# Altium schematic sheet hwmon_1.SchDoc: Hardware Monitoring
size A3; Date: DO NOT USE, RATHER USE PROJ OPTIONS; DrawnBy: DO NOT USE, RATHER USE PROJ OPTIONS; Engineer: DO NOT USE, RATHER USE PROJ OPTIONS; Organization: DO NOT USE, RATHER USE PROJ OPTIONS; DocumentNumber: DO NOT USE, RATHER USE PROJ OPTIONS; Revision: DO NOT USE, RATHER USE PROJ OPTIONS; SheetNumber: 3; SheetTotal: 29; SCH_Sheet_Filename: hwmon_1.SchDoc; CurrentTime: DO NOT USE, RATHER USE PROJ OPTIONS; Time: DO NOT USE, RATHER USE PROJ OPTIONS; DocumentFullPathAndName: DO NOT USE, RATHER USE PROJ OPTIONS; DocumentName: DO NOT USE, RATHER USE PROJ OPTIONS; ModifiedDate: DO NOT USE, RATHER USE PROJ OPTIONS; ImagePath: DO NOT USE, RATHER USE PROJ OPTIONS
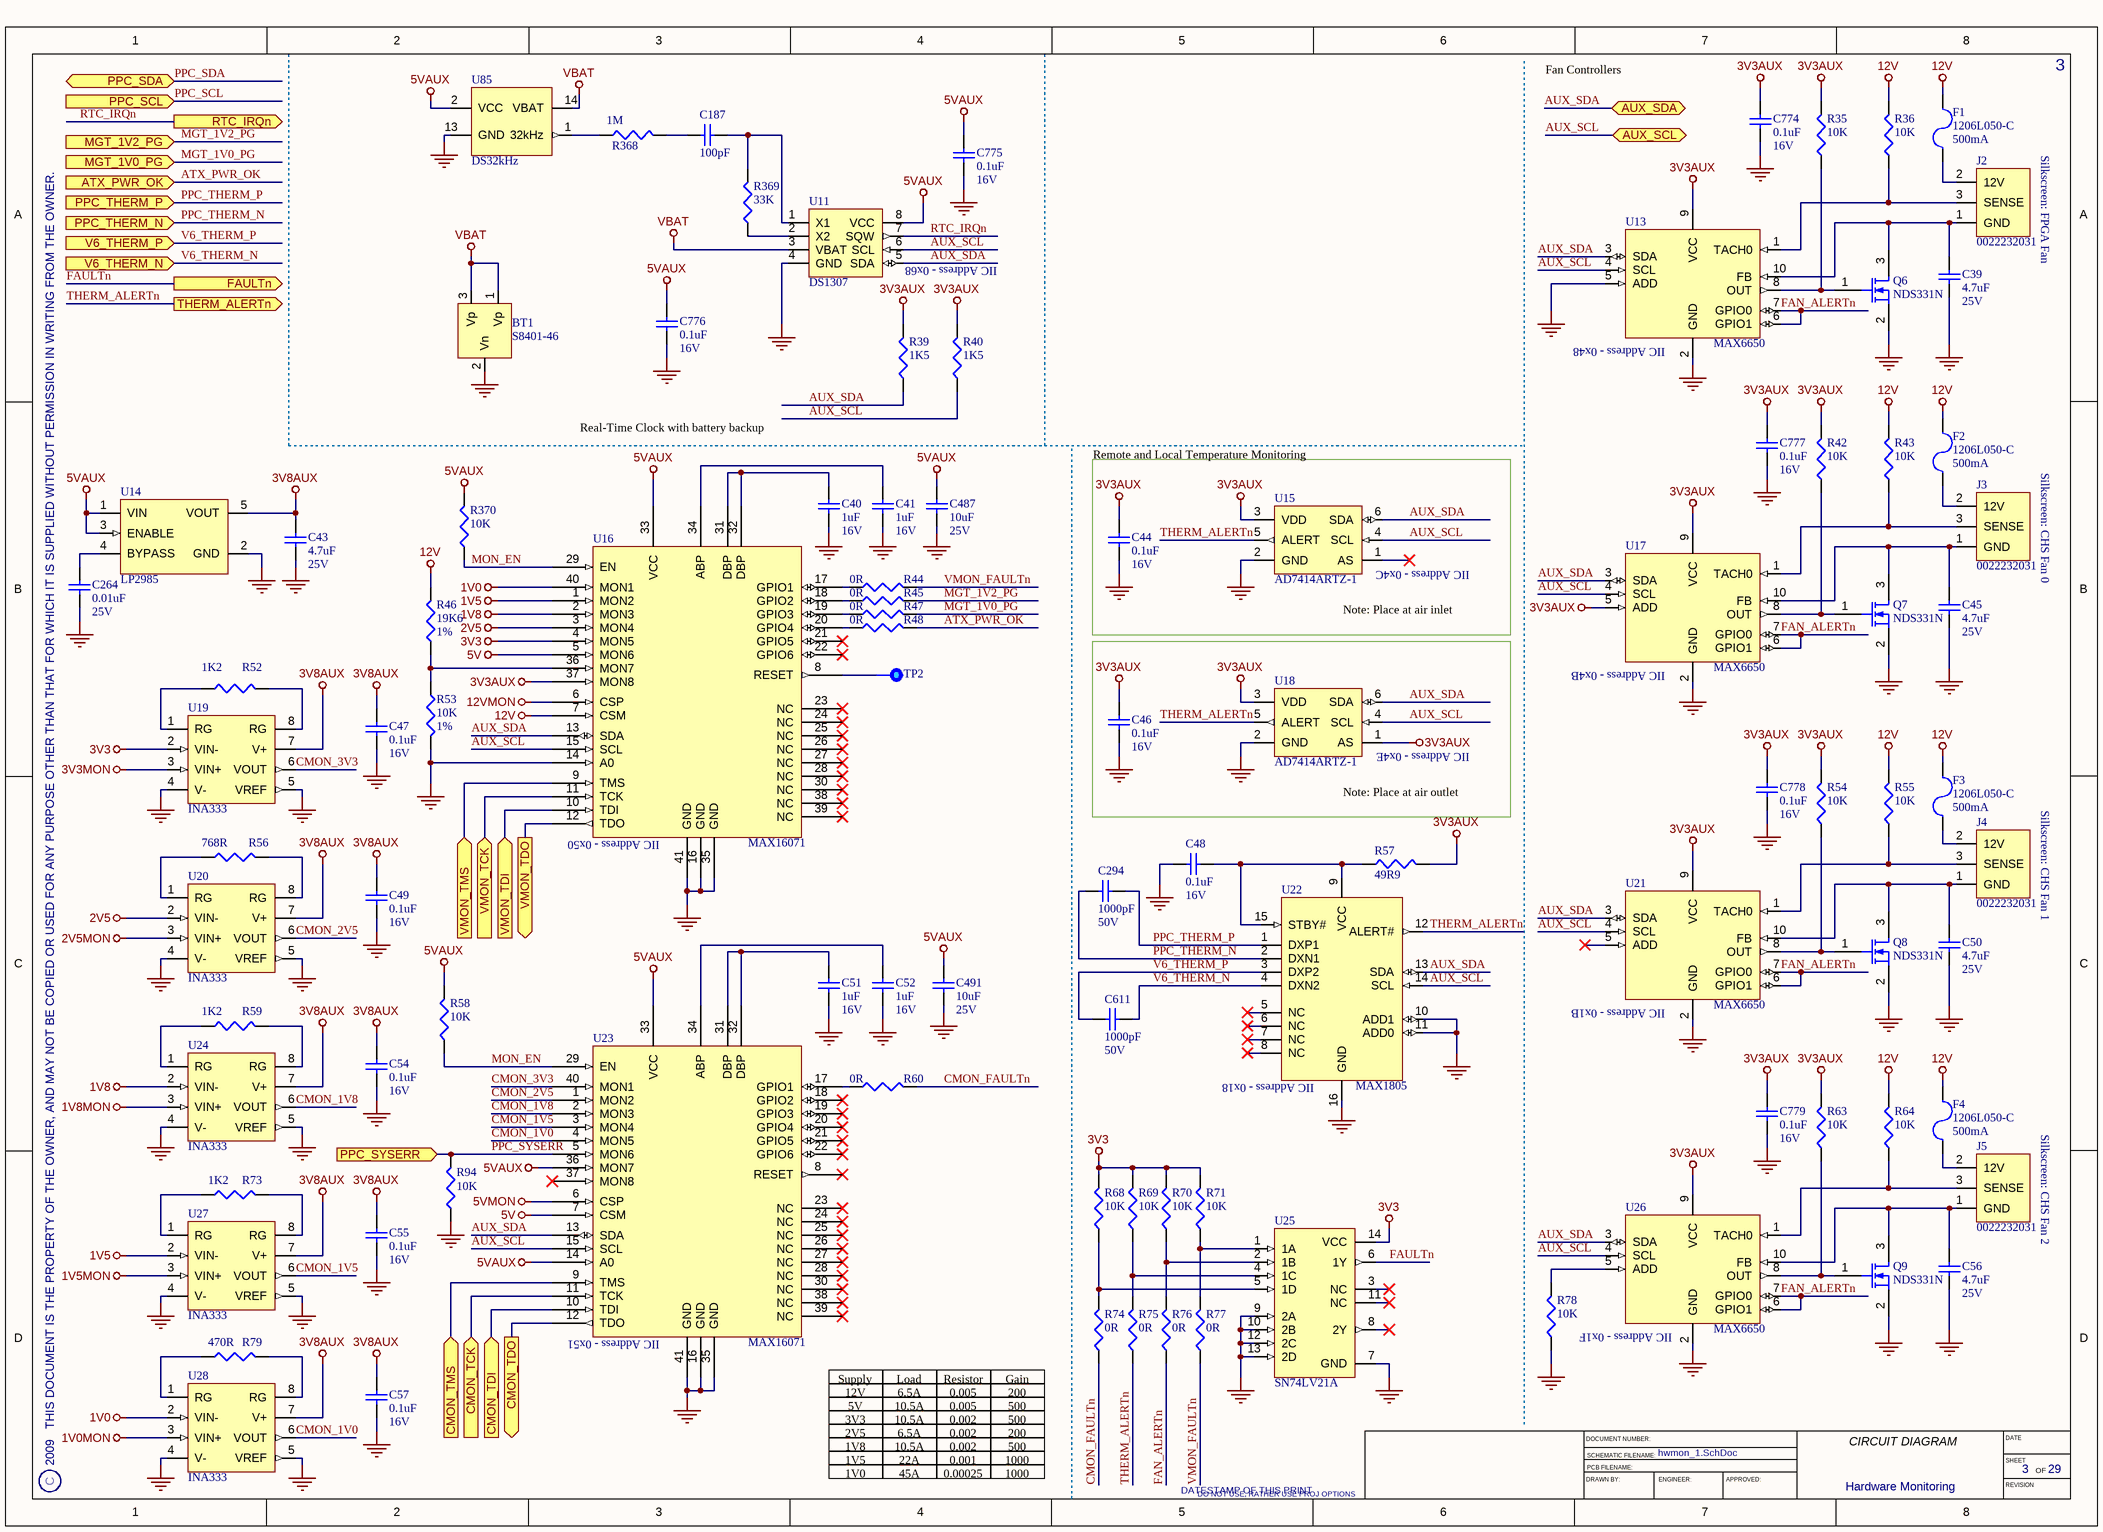
[diagram p0: hwmon_1.SchDoc]

## Parts
BT1  S8401-46  [HARWIN_S8401-46]
C39  Rating: 25V  [CAPC2012X127L]  (hidden comment: 4.7uF)
C40  Rating: 16V  [CAPC2012X127L]  (hidden comment: 1uF)
C41  Rating: 16V  [CAPC2012X127L]  (hidden comment: 1uF)
C43  Rating: 25V  [CAPC2012X127L]  (hidden comment: 4.7uF)
C44  Rating: 16V  [CAPC1005X60L]  (hidden comment: 0.1uF)
C45  Rating: 25V  [CAPC2012X127L]  (hidden comment: 4.7uF)
C46  Rating: 16V  [CAPC1005X60L]  (hidden comment: 0.1uF)
C47  Rating: 16V  [CAPC1005X60L]  (hidden comment: 0.1uF)
C48  Rating: 16V  [CAPC1005X60L]  (hidden comment: 0.1uF)
C49  Rating: 16V  [CAPC1005X60L]  (hidden comment: 0.1uF)
C50  Rating: 25V  [CAPC2012X127L]  (hidden comment: 4.7uF)
C51  Rating: 16V  [CAPC2012X127L]  (hidden comment: 1uF)
C52  Rating: 16V  [CAPC2012X127L]  (hidden comment: 1uF)
C54  Rating: 16V  [CAPC1005X60L]  (hidden comment: 0.1uF)
C55  Rating: 16V  [CAPC1005X60L]  (hidden comment: 0.1uF)
C56  Rating: 25V  [CAPC2012X127L]  (hidden comment: 4.7uF)
C57  Rating: 16V  [CAPC1005X60L]  (hidden comment: 0.1uF)
C187  100pF  [CAPC1005X55L]
C264  value 0.01uF  Rating: 25V  [CAPC1005X55L]  (hidden comment: CapStd)
C294  Rating: 50V  [CAPC1005X55L]  (hidden comment: 1000pF)
C487  Rating: 25V  [CAPC3225X200L]  (hidden comment: 10uF)
C491  Rating: 25V  [CAPC3225X200L]  (hidden comment: 10uF)
C611  Rating: 50V  [CAPC1005X55L]  (hidden comment: 1000pF)
C774  Rating: 16V  [CAPC1005X60L]  (hidden comment: 0.1uF)
C775  Rating: 16V  [CAPC1005X60L]  (hidden comment: 0.1uF)
C776  Rating: 16V  [CAPC1005X60L]  (hidden comment: 0.1uF)
C777  Rating: 16V  [CAPC1005X60L]  (hidden comment: 0.1uF)
C778  Rating: 16V  [CAPC1005X60L]  (hidden comment: 0.1uF)
C779  Rating: 16V  [CAPC1005X60L]  (hidden comment: 0.1uF)
F1  Rating: 500mA  [FUSMC3215X145]  (hidden comment: 1206L050-C)
F2  Rating: 500mA  [FUSMC3215X145]  (hidden comment: 1206L050-C)
F3  Rating: 500mA  [FUSMC3215X145]  (hidden comment: 1206L050-C)
F4  Rating: 500mA  [FUSMC3215X145]  (hidden comment: 1206L050-C)
J2  0022232031  [MOLEX_0022232031]
J3  0022232031  [MOLEX_0022232031]
J4  0022232031  [MOLEX_0022232031]
J5  0022232031  [MOLEX_0022232031]
Q6  NDS331N  [SOT95P245X110-3N]
Q7  NDS331N  [SOT95P245X110-3N]
Q8  NDS331N  [SOT95P245X110-3N]
Q9  NDS331N  [SOT95P245X110-3N]
R35  10K  [RESC1005X40L]
R36  10K  [RESC1005X40L]
R39  1K5  [RESC1005X40L]
R40  1K5  [RESC1005X40L]
R42  10K  [RESC1005X40L]
R43  10K  [RESC1005X40L]
R44  0R  [RESC1005X40L]
R45  0R  [RESC1005X40L]
R46  Tolerance: 1%  [RESC1005X40L]  (hidden comment: 19K6)
R47  0R  [RESC1005X40L]
R48  0R  [RESC1005X40L]
R52  1K2  [RESC1005X40L]
R53  Tolerance: 1%  [RESC1005X40L]  (hidden comment: 10K)
R54  10K  [RESC1005X40L]
R55  10K  [RESC1005X40L]
R56  768R  [RESC1005X40L]
R57  49R9  [RESC1005X40L]
R58  10K  [RESC1005X40L]
R59  1K2  [RESC1005X40L]
R60  0R  [RESC1005X40L]
R63  10K  [RESC1005X40L]
R64  10K  [RESC1005X40L]
R68  10K  [RESC1005X40L]
R69  10K  [RESC1005X40L]
R70  10K  [RESC1005X40L]
R71  10K  [RESC1005X40L]
R73  1K2  [RESC1005X40L]
R74  0R  [RESC1005X40L]
R75  0R  [RESC1005X40L]
R76  0R  [RESC1005X40L]
R77  0R  [RESC1005X40L]
R78  10K  [RESC1005X40L]
R79  470R  [RESC1005X40L]
R94  10K  [RESC1005X40L]
R368  1M  [RESC1005X40L]
R369  33K  [RESC1005X40L]
R370  10K  [RESC1005X40L]
TP2  Testpoint  [TP100]  (value not drawn)  (no BOM)
U11  DS1307  [SOIC150-8_N]
U13  MAX6650  [10L_uMAX]
U14  LP2985  [SOT23-5]
U15  AD7414ARTZ-1  [SOT23-6]
U16  MAX16071  [TQFN-40]
U17  MAX6650  [10L_uMAX]
U18  AD7414ARTZ-1  [SOT23-6]
U19  INA333  [PW08]
U20  INA333  [PW08]
U21  MAX6650  [10L_uMAX]
U22  MAX1805  [QSOP-16]
U23  MAX16071  [TQFN-40]
U24  INA333  [PW08]
U25  SN74LV21A  [PW014]
U26  MAX6650  [10L_uMAX]
U27  INA333  [PW08]
U28  INA333  [PW08]
U85  DS32kHz  [SOIC127P1030X267-16N]

## Blocks framed on the sheet
IIC Address - 0x4C: C44 U15
IIC Address - 0x4E: C46 U18

## Ports
ATX_PWR_OK (in), AUX_SCL (bidir), AUX_SDA (bidir), CMON_TCK (in), CMON_TDI (in), CMON_TDO (out), CMON_TMS (in), FAULTn (out), MGT_1V0_PG (in), MGT_1V2_PG (in), PPC_SCL (in), PPC_SDA (bidir), PPC_SYSERR (in), PPC_THERM_N (in), PPC_THERM_P (in), RTC_IRQn (out), THERM_ALERTn (out), V6_THERM_N (in), V6_THERM_P (in), VMON_TCK (in), VMON_TDI (in), VMON_TDO (out), VMON_TMS (in)

## Nets
1V0: U16.40(MON1) U28.2(VIN-)
1V0MON: U28.3(VIN+)
1V5: U16.1(MON2) U27.2(VIN-)
1V5MON: U27.3(VIN+)
1V8: U16.2(MON3) U24.2(VIN-)
1V8MON: U24.3(VIN+)
2V5: U16.3(MON4) U20.2(VIN-)
2V5MON: U20.3(VIN+)
3V3: R68.2 R69.2 R70.2 R71.2 U16.4(MON5) U19.2(VIN-) U25.14(VCC)
3V3AUX: C44.2 C46.2 C774.2 C777.2 C778.2 C779.2 R35.2 R39.2 R40.2 R42.2 R54.2 R57.2 R63.2 U13.9(VCC) U15.3(VDD) U16.37(MON8) U17.5(ADD) U17.9(VCC) U18.1(AS) U18.3(VDD) U21.9(VCC) U26.9(VCC)
3V3MON: U19.3(VIN+)
3V8AUX: C43.2 C47.2 C49.2 C54.2 C55.2 C57.2 U14.5(VOUT) U19.7(V+) U20.7(V+) U24.7(V+) U27.7(V+) U28.7(V+)
5V: U16.5(MON6) U23.7(CSM)
5VAUX: C487.2 C491.2 C775.2 C776.2 R58.2 R370.2 U11.8(VCC) U14.1(VIN) U14.3(ENABLE) U16.33(VCC) U23.14(A0) U23.33(VCC) U23.36(MON7) U85.2(VCC)
5VMON: U23.6(CSP)
12V: F1.1 F2.1 F3.1 F4.1 R36.2 R43.2 R46.2 R55.2 R64.2 U16.7(CSM)
12VMON: U16.6(CSP)
GND: BT1.2(Vn) C39.1 C40.1 C41.1 C43.1 C44.1 C45.1 C46.1 C47.1 C48.2 C49.1 C50.1 C51.1 C52.1 C54.1 C55.1 C56.1 C57.1 C264.1 C487.1 C491.1 C774.1 C775.1 C776.1 C777.1 C778.1 C779.1 Q6.2(S) Q7.2(S) Q8.2(S) Q9.2(S) R53.2 R78.1 R94.1 U11.4(GND) U13.2(GND) U13.5(ADD) U14.2(GND) U15.2(GND) U16.14(A0) U16.16(GND) U16.35(GND) U16.41(GND) U17.2(GND) U18.2(GND) U19.4(V-) U19.5(VREF) U20.4(V-) U20.5(VREF) U21.2(GND) U22.10(ADD1) U22.11(ADD0) U22.16(GND) U23.16(GND) U23.35(GND) U23.41(GND) U24.4(V-) U24.5(VREF) U25.7(GND) U25.9(2A) U25.10(2B) U25.12(2C) U25.13(2D) U26.2(GND) U27.4(V-) U27.5(VREF) U28.4(V-) U28.5(VREF) U85.13(GND)
VBAT: BT1.1(Vp) BT1.3(Vp) U11.3(VBAT) U85.14(VBAT)
ATX_PWR_OK: R48.2 ; port ATX_PWR_OK
AUX_SCL: R40.1 U11.6(SCL) U13.4(SCL) U15.4(SCL) U16.15(SCL) U17.4(SCL) U18.4(SCL) U21.4(SCL) U22.14(SCL) U23.15(SCL) U26.4(SCL) ; port AUX_SCL
AUX_SDA: R39.1 U11.5(SDA) U13.3(SDA) U15.6(SDA) U16.13(SDA) U17.3(SDA) U18.6(SDA) U21.3(SDA) U22.13(SDA) U23.13(SDA) U26.3(SDA) ; port AUX_SDA
CMON_1V0: U23.4(MON5) U28.6(VOUT)
CMON_1V5: U23.3(MON4) U27.6(VOUT)
CMON_1V8: U23.2(MON3) U24.6(VOUT)
CMON_2V5: U20.6(VOUT) U23.1(MON2)
CMON_3V3: U19.6(VOUT) U23.40(MON1)
CMON_FAULTn: R60.2 R74.1
CMON_TCK: U23.11(TCK) ; port CMON_TCK
CMON_TDI: U23.10(TDI) ; port CMON_TDI
CMON_TDO: U23.12(TDO) ; port CMON_TDO
CMON_TMS: U23.9(TMS) ; port CMON_TMS
FAN_ALERTn: R76.1 U13.6(GPIO1) U13.7(GPIO0) U17.6(GPIO1) U17.7(GPIO0) U21.6(GPIO1) U21.7(GPIO0) U26.6(GPIO1) U26.7(GPIO0)
FAULTn: U25.6(1Y) ; port FAULTn
MGT_1V0_PG: R47.2 ; port MGT_1V0_PG
MGT_1V2_PG: R45.2 ; port MGT_1V2_PG
MON_EN: R58.1 R370.1 U16.29(EN) U23.29(EN)
PPC_SCL: port PPC_SCL
PPC_SDA: port PPC_SDA
PPC_SYSERR: R94.2 U23.5(MON6) ; port PPC_SYSERR
PPC_THERM_N: C294.1 U22.2(DXN1) ; port PPC_THERM_N
PPC_THERM_P: C294.2 U22.1(DXP1) ; port PPC_THERM_P
RTC_IRQn: U11.7(SQW) ; port RTC_IRQn
THERM_ALERTn: R75.1 U15.5(ALERT) U18.5(ALERT) U22.12(ALERT#) ; port THERM_ALERTn
V6_THERM_N: C611.1 U22.4(DXN2) ; port V6_THERM_N
V6_THERM_P: C611.2 U22.3(DXP2) ; port V6_THERM_P
VMON_FAULTn: R44.2 R77.1
VMON_TCK: U16.11(TCK) ; port VMON_TCK
VMON_TDI: U16.10(TDI) ; port VMON_TDI
VMON_TDO: U16.12(TDO) ; port VMON_TDO
VMON_TMS: U16.9(TMS) ; port VMON_TMS
NetC39_2: C39.2 J2.1(GND) Q6.3(D) U13.10(FB)
NetC40_2: C40.2 U16.31(DBP) U16.32(DBP)
NetC41_2: C41.2 U16.34(ABP)
NetC45_2: C45.2 J3.1(GND) Q7.3(D) U17.10(FB)
NetC48_1: C48.1 R57.1 U22.9(VCC) U22.15(STBY#)
NetC50_2: C50.2 J4.1(GND) Q8.3(D) U21.10(FB)
NetC51_2: C51.2 U23.31(DBP) U23.32(DBP)
NetC52_2: C52.2 U23.34(ABP)
NetC56_2: C56.2 J5.1(GND) Q9.3(D) U26.10(FB)
NetC187_1: C187.1 R369.2 U11.1(X1)
NetC187_2: C187.2 R368.2
NetC264_2: C264.2 U14.4(BYPASS)
NetF1_2: F1.2 J2.2(12V)
NetF2_2: F2.2 J3.2(12V)
NetF3_2: F3.2 J4.2(12V)
NetF4_2: F4.2 J5.2(12V)
NetJ2_3: J2.3(SENSE) R36.1 U13.1(TACH0)
NetJ3_3: J3.3(SENSE) R43.1 U17.1(TACH0)
NetJ4_3: J4.3(SENSE) R55.1 U21.1(TACH0)
NetJ5_3: J5.3(SENSE) R64.1 U26.1(TACH0)
NetQ6_1: Q6.1(G) R35.1 U13.8(OUT)
NetQ7_1: Q7.1(G) R42.1 U17.8(OUT)
NetQ8_1: Q8.1(G) R54.1 U21.8(OUT)
NetQ9_1: Q9.1(G) R63.1 U26.8(OUT)
NetR44_1: R44.1 U16.17(GPIO1)
NetR45_1: R45.1 U16.18(GPIO2)
NetR46_1: R46.1 R53.1 U16.36(MON7)
NetR47_1: R47.1 U16.19(GPIO3)
NetR48_1: R48.1 U16.20(GPIO4)
NetR52_1: R52.1 U19.1(RG)
NetR52_2: R52.2 U19.8(RG)
NetR56_1: R56.1 U20.1(RG)
NetR56_2: R56.2 U20.8(RG)
NetR59_1: R59.1 U24.1(RG)
NetR59_2: R59.2 U24.8(RG)
NetR60_1: R60.1 U23.17(GPIO1)
NetR68_1: R68.1 R74.2 U25.5(1D)
NetR69_1: R69.1 R75.2 U25.4(1C)
NetR70_1: R70.1 R76.2 U25.2(1B)
NetR71_1: R71.1 R77.2 U25.1(1A)
NetR73_1: R73.1 U27.1(RG)
NetR73_2: R73.2 U27.8(RG)
NetR78_2: R78.2 U26.5(ADD)
NetR79_1: R79.1 U28.1(RG)
NetR79_2: R79.2 U28.8(RG)
NetR368_1: R368.1 U85.1(32kHz)
NetR369_1: R369.1 U11.2(X2)
NetTP2_1: TP2.1 U16.8(RESET)

Not connected (* = marked no-connect by the designer): U15 1(AS)*; U16 21(GPIO5)* 22(GPIO6)* 23(NC)* 24(NC)* 25(NC)* 26(NC)* 27(NC)* 28(NC)* 30(NC)* 38(NC)* 39(NC)*; U21 5(ADD)*; U22 5(NC)* 6(NC)* 7(NC)* 8(NC)*; U23 8(RESET)* 18(GPIO2)* 19(GPIO3)* 20(GPIO4)* 21(GPIO5)* 22(GPIO6)* 23(NC)* 24(NC)* 25(NC)* 26(NC)* 27(NC)* 28(NC)* 30(NC)* 37(MON8)* 38(NC)* 39(NC)*; U25 3(NC)* 8(2Y)* 11(NC)*; U85 3(NC) 4(NC) 5(NC) 6(NC) 7(NC) 8(NC) 9(NC) 10(NC) 11(NC) 12(NC) 15(NC) 16(NC)

## Notes on the sheet
- (near C774) Fan Controllers
- Silkscreen: FPGA Fan
- (near U11) IIC Address - 0x68
- (near U13) IIC Address - 0x48
- Real-Time Clock with battery backup
- Remote and Local Temperature Monitoring
- Silkscreen: CHS Fan 0
- (near U15) Note: Place at air inlet
- (near U17) IIC Address - 0x4B
- Silkscreen: CHS Fan 1
- (near U16) IIC Address - 0x50
- Note: Place at air outlet
- (near U21) IIC Address - 0x1B
- (near U22) IIC Address - 0x18
- Silkscreen: CHS Fan 2
- (near U23) IIC Address - 0x51
- IIC Address - 0x1F
- (near U23) Supply
- 12V
- 5V
- 3V3
- Load
- 6.5A
- 10.5A
- Resistor
- 0.005
- 0.002
- Gain
- 200
- 500
- 2V5
- 1V8
- 1V5
- 1V0
- 22A
- 45A
- 0.001
- 0.00025
- 1000
- 2009   THIS DOCUMENT IS THE PROPERTY OF THE OWNER, AND MAY NOT BE COPIED OR USED FOR ANY PURPOSE OTHER THAN THAT FOR WHICH IT IS SUPPLIED WITHOUT PERMISSION IN WRITING FROM THE OWNER.
- C
- DATESTAMP OF THIS PRINT
- DRAWN BY:
- DOCUMENT NUMBER:
- SCHEMATIC FILENAME:
- PCB FILENAME:
- ENGINEER:
- APPROVED:
- CIRCUIT DIAGRAM
- DATE
- SHEET
- REVISION
- OF

## Library data of the parts
BT1 = ELMECH-BAT-4: Vertical, Through Hole Mount CR 2032, 20mm Coin Cell Retainer; Manufacturer: Harwin; POD number: ELMECH-BAT-4; PartNum: S8401-46; RoHS: Y; Category: ELMECH; Subcategory: Batteries
C39 C43 C45 C50 C56 = CAP-CER-3: 4.7uF, Ceramic Capacitor; Manufacturer: MURATA; PartNum: GRM21BR61E475KA12K; Tolerance: 10%; Dielectric: X5R; POD number: CAP-CER-3; Value: 4.7uF; RoHS: Y; Sort Value: 4.7; Category: Capacitors; Subcategory: Ceramic
C40 C41 C51 C52 = CAP-CER-8: 1uF, Ceramic Capacitor; Manufacturer: MURATA; PartNum: GRM21BR61C105KA01L; Tolerance: 10%; Dielectric: X5R; POD number: CAP-CER-8; Value: 1uF; RoHS: Y; Sort Value: 100; Category: Capacitors; Subcategory: Ceramic
C44 C46-C49 C54 C55 C57 C774-C779 = CAP-CER-1: 0.1uF, Ceramic Capacitor; Manufacturer: VENKEL; PartNum: C0402X7R160-104KN; Tolerance: 10%; Dielectric: X7R; POD number: CAP-CER-1; Value: 0.1uF; RoHS: Y; Sort Value: 0.1; Category: Capacitors; Subcategory: Ceramic
C187 = CAP-CER-14: 100pF, Ceramic Capacitor; Manufacturer: MURATA; PartNum: GRM1555C1H101JA01D; Tolerance: 5%; Rating: 50V; Dielectric: C0G; POD number: CAP-CER-14; RoHS: Y; Value: 100pF; Sort Value: 0.0001; Category: Capacitors; Subcategory: Ceramic
C264 = CAP-CER-6: 0.01uF, Ceramic Capacitor; POD number: CAP-CER-6
C294 C611 = CAP-CER-4: 1000pF, Ceramic Capacitor; Manufacturer: MURATA; PartNum: GRM155R61H102KA01D; Tolerance: 10%; Dielectric: X5R; POD number: CAP-CER-4; Value: 1000pF; RoHS: Y; Sort Value: 0.0001; Category: Capacitors; Subcategory: Ceramic
C487 C491 = CAP-CER-5: 10uF, Ceramic Capacitor; Manufacturer: MURATA; PartNum: GRM32DR61E106KA12L; Tolerance: 10%; Dielectric: X5R; POD number: CAP-CER-5; Value: 10uF; RoHS: Y; Sort Value: 100; Category: Capacitors; Subcategory: Ceramic
F1-F4 = ELMECH-FUSE-0: Resettable, Surface mount Fuse; Manufacturer: Littelfuse; POD number: ELMECH-FUSE-0; PartNum: 1206L050-C; RoHS: Y; Category: ELMECH; Subcategory: Fuses
J2-J5 = CONN-PCB-6: 3-pin ATX Fan Connector; Manufacturer: Molex; POD number: CONN-PCB-6; PartNum: 0022232031; RoHS: Y; Category: CONN; Subcategory: PCB
Q6-Q9 = TRANS-NFET-1: N-Channel Logic Level Enhancement Mode Field Effect Transistor; Manufacturer: Fairchild Semiconductor; Rating: 1.3A; POD number: TRANS-NFET-1; PartNum: NDS331N; RoHS: Y; Category: TRANS; Subcategory: NFET
R35 R36 R42 R43 R54 R55 R58 R63 R64 R68-R71 R78 R94 R370 = RES-TF-5: 10K, 1.1mm x 0.5mm, Thick Film Resistor; Manufacturer: ROYALOHM; PartNum: 0402WGJ0103T1E; Tolerance: 5%; Rating: 0.0625W; POD number: RES-TF-5; Value: 10K; Sort Value: 10000; Category: Resistors; Subcategory: ThickFilm; HelpURL: *.pdf
R39 R40 = RES-TF-50: 1K5, 1.1mm x 0.5mm, Thick Film Resistor; Manufacturer: ROYALOHM; PartNum: 0402WGF1501T1E; Tolerance: 1%; Rating: 0.0625W; POD number: RES-TF-50; RoHS: Y; Value: 1K5; Sort Value: 1500; Category: Resistors; Subcategory: ThickFilm; HelpURL: http://www.royalohm.com/pdf/general.pdf
R44 R45 R47 R48 R60 R74-R77 = RES-TF-0: 0R, 1.1mm x 0.5mm, Thick Film Resistor; Manufacturer: ROYALOHM; PartNum: 0402WG00000T1E; Tolerance: 0%; Rating: 0.0625W; POD number: RES-TF-0; Value: 0R; Sort Value: 0; Category: Resistors; Subcategory: ThickFilm; HelpURL: *.pdf
R46 = RES-TF-29: 19K6, 1.1mm x 0.5mm, Thick Film Resistor; Manufacturer: ROYALOHM; PartNum: 0402WGF1962T1E; Rating: 0.0625W; POD number: RES-TF-29; Value: 19K6; Sort Value: 19600; Category: Resistors; Subcategory: ThickFilm; HelpURL: *.pdf
R52 R59 R73 = RES-TF-49: 1K2, 1.1mm x 0.5mm, Thick Film Resistor; Manufacturer: ROYALOHM; PartNum: 0402WGF1201T1E; Tolerance: 1%; Rating: 0.0625W; POD number: RES-TF-49; RoHS: Y; Value: 1K2; Sort Value: 1200; Category: Resistors; Subcategory: ThickFilm; HelpURL: http://www.royalohm.com/pdf/general.pdf
R53 = RES-TF-20: 10K, 1.1mm x 0.5mm, Thick Film Resistor; Manufacturer: ROYALOHM; PartNum: 0402WGF0103T1E; Rating: 0.0625W; POD number: RES-TF-20; Value: 10K; Sort Value: 10000; Category: Resistors; Subcategory: ThickFilm; HelpURL: *.pdf
R56 = RES-TF-48: 768R, 1.1mm x 0.5mm, Thick Film Resistor; Manufacturer: ROYALOHM; PartNum: 0402WGF7680T1E; Tolerance: 1%; Rating: 0.0625W; POD number: RES-TF-48; RoHS: Y; Value: 768R; Sort Value: 768; Category: Resistors; Subcategory: ThickFilm; HelpURL: http://www.royalohm.com/pdf/general.pdf
R57 = RES-TF-10: 49R9, 1.1mm x 0.5mm, Thick Film Resistor; Manufacturer: ROYALOHM; PartNum: 0402WGF499JT1E; Tolerance: 1%; Rating: 0.0625W; POD number: RES-TF-10; Value: 49R9; Sort Value: 49.9; Category: Resistors; Subcategory: ThickFilm; HelpURL: *.pdf
R79 = RES-TF-47: 470R, 1.1mm x 0.5mm, Thick Film Resistor; Manufacturer: ROYALOHM; PartNum: 0402WGF4700T1E; Tolerance: 1%; Rating: 0.0625W; POD number: RES-TF-47; RoHS: Y; Value: 470R; Sort Value: 470; Category: Resistors; Subcategory: ThickFilm; HelpURL: http://www.royalohm.com/pdf/general.pdf
R368 = RES-TF-53: 1M, 1.1mm x 0.5mm, Thick Film Resistor; Manufacturer: ROYALOHM; PartNum: 0402WGF1004T1E; Tolerance: 1%; Rating: 0.0625W; POD number: RES-TF-53; RoHS: Y; Value: 1M; Sort Value: 1000000; Category: Resistors; Subcategory: ThickFilm; HelpURL: http://www.royalohm.com/pdf/general.pdf
R369 = RES-TF-52: 33K, 1.1mm x 0.5mm, Thick Film Resistor; Manufacturer: ROYALOHM; PartNum: 0402WGF3302T1E; Tolerance: 1%; Rating: 0.0625W; POD number: RES-TF-52; RoHS: Y; Value: 33K; Sort Value: 33000; Category: Resistors; Subcategory: ThickFilm; HelpURL: http://www.royalohm.com/pdf/general.pdf
TP2 = ELMECH-TP-0: 1mm Diameter, through-hole, Circular Test-point; POD number: ELMECH-TP-0; RoHS: Y; Category: ELMECH; Subcategory: Test Points
U11 = IC-MON-5: I2C Real-Time Clock; Manufacturer: Maxim; POD number: IC-MON-5; PartNum: DS1307; RoHS: Y; Category: IC; Subcategory: Monitoring
U13 U17 U21 U26 = IC-MON-2: Fan-Speed Regulators and Monitors with SMBus/I2C-Compatible Interface; Manufacturer: MAXIM; POD number: IC-MON-2; PartNum: MAX6650; RoHS: Y; Category: IC; Subcategory: Monitoring
U14 = IC-REG-8: Micropower, 150mA Low-Noise Ultra Low-Dropout CMOS 3.8V Voltage Regulator in SOT23-5; POD number: IC-REG-8
U15 U18 = IC-MON-6: 0.5 C Accurate, 10-bit Temperature Sensor; Manufacturer: Analog Devices; POD number: IC-MON-6; PartNum: AD7414ARTZ-1; RoHS: Y; Category: IC; Subcategory: Monitoring
U16 U23 = IC-MON-3: 8-Channel, Flash-Configurable System Monitor with Nonvolatile Fault Registers; Manufacturer: Maxim; PartNum: MAX16071ETL+; POD number: IC-MON-3; RoHS: Y; Category: IC; Subcategory: Monitoring
U19 U20 U24 U27 U28 = IC-AMP-0: Micro-Power, Zero-Drift, Rail-to-Rail Out Instrumentation Amplifier; Manufacturer: Texas Instruments; POD number: IC-AMP-0; PartNum: INA333; RoHS: Y; Category: IC; Subcategory: Amplifiers
U22 = IC-MON-1: Multichannel Remote/Local Temperature Sensors; Manufacturer: Maxim; POD number: IC-MON-1; PartNum: MAX1805; RoHS: Y; Category: IC; Subcategory: Monitoring
U25 = IC-LOG-2: Dual 4-Input Positive-AND Gates; Manufacturer: Texas Instruments; POD number: IC-LOG-2; PartNum: SN74LV21A; RoHS: Y; Category: IC; Subcategory: Logic
U85 = IC-MON-7: Temperature Compensated, 32.768 kHz Crystal Oscillator; Manufacturer: MAXIM; POD number: IC-MON-7; PartNum: DS32kHz; RoHS: Y; Category: IC; Subcategory: Monitoring